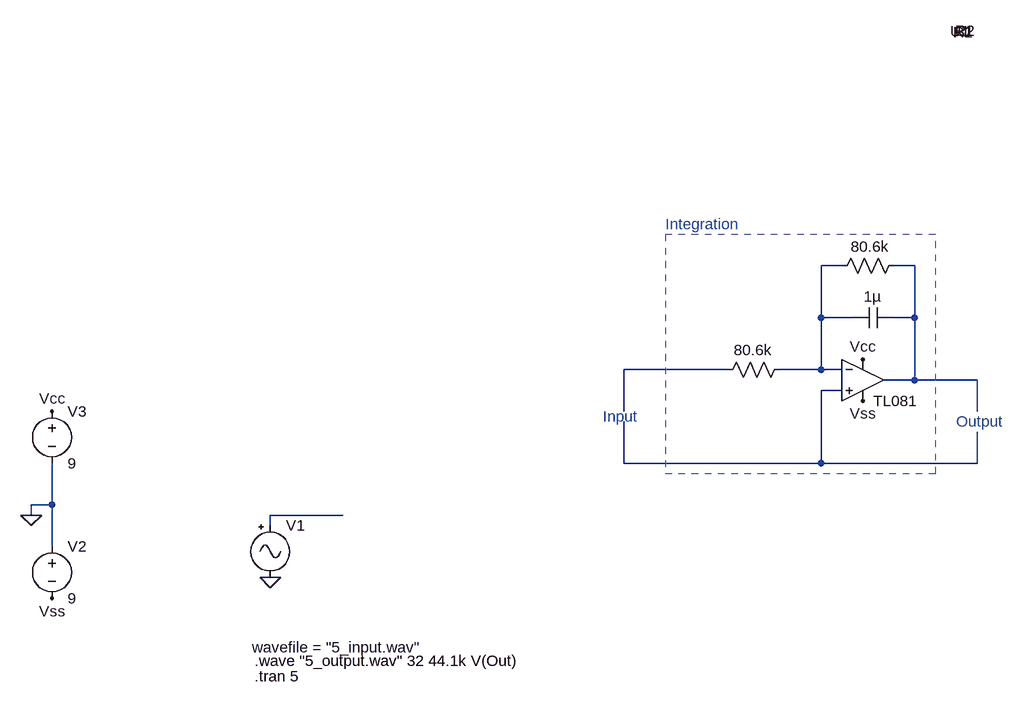
[diagram p0: schematic 5_Integrator.asc]
5_Integrator.asc, the LTspice schematic file:
Version 4
SHEET 1 1028 680
WIRE 768 -176 736 -176
WIRE 880 -176 848 -176
WIRE 736 -96 736 -176
WIRE 784 -96 736 -96
WIRE 880 -96 880 -176
WIRE 880 -96 848 -96
WIRE 592 -16 432 -16
WIRE 736 -16 736 -96
WIRE 736 -16 672 -16
WIRE 768 -16 736 -16
WIRE 880 0 880 -96
WIRE 880 0 832 0
WIRE 976 0 880 0
WIRE 768 16 736 16
WIRE 432 48 432 -16
WIRE 976 48 976 0
WIRE 432 128 432 64
WIRE 736 128 736 16
WIRE 736 128 432 128
WIRE 976 128 976 80
WIRE 976 128 736 128
WIRE -448 192 -448 128
WIRE -448 192 -480 192
WIRE -480 208 -480 192
WIRE 0 208 -112 208
WIRE -112 224 -112 208
WIRE -448 256 -448 192
FLAG -112 304 0
FLAG -480 208 0
FLAG -448 48 Vcc
FLAG -448 336 Vss
FLAG 800 -32 Vcc
FLAG 800 32 Vss
SYMBOL Misc\\signal -112 208 R0
WINDOW 3 -28 203 Left 2
SYMATTR Value wavefile = "5_input.wav"
SYMATTR InstName V1
SYMBOL voltage -448 240 R0
WINDOW 123 0 0 Left 0
WINDOW 39 0 0 Left 0
SYMATTR InstName V2
SYMATTR Value 9
SYMBOL voltage -448 32 R0
WINDOW 123 0 0 Left 0
WINDOW 39 0 0 Left 0
SYMATTR InstName V3
SYMATTR Value 9
SYMBOL AutoGenerated\\TL081 800 -64 R0
WINDOW 0 135 -473 Left 2
SYMATTR InstName U1
SYMBOL cap 848 -112 R90
WINDOW 0 -410 -108 VBottom 2
WINDOW 3 -32 33 VTop 2
SYMATTR InstName C1
SYMATTR Value 1µ
SYMBOL res 864 -192 R90
WINDOW 0 -328 -91 VBottom 2
WINDOW 3 -29 53 VTop 2
SYMATTR InstName R1
SYMATTR Value 80.6k
SYMBOL res 688 -32 R90
WINDOW 0 -490 -270 VBottom 2
WINDOW 3 -30 57 VTop 2
SYMATTR InstName R2
SYMATTR Value 80.6k
TEXT -136 456 Left 2 !.tran 5
TEXT -136 432 Left 2 !.wave "5_output.wav" 32 44.1k V(Out)
TEXT 496 -240 Left 2 ;Integration
TEXT 944 64 Left 2 ;Output
TEXT 400 56 Left 2 ;Input
RECTANGLE Normal 496 144 912 -224 2

The netlist it stands for:
* 5_Integrator.asc
V1 N005 0 wavefile = "5_input.wav"
V2 0 Vss 9
V3 Vcc 0 9
* U1: TL081 (symbol AutoGenerated\TL081 not available, pins judged from their places): In+=N004 In-=N001 V+=Vcc V-=Vss OUT=N002
C1 N002 N001 1µ
R1 N002 N001 80.6k
R2 N001 N003 80.6k
.tran 5
.wave "5_output.wav" 32 44.1k V(Out)
* Integration
* Output
* Input
.backanno
.end